# Altium project BRZ_BATT_MANAGER.PrjPcb (part 1 of 2)
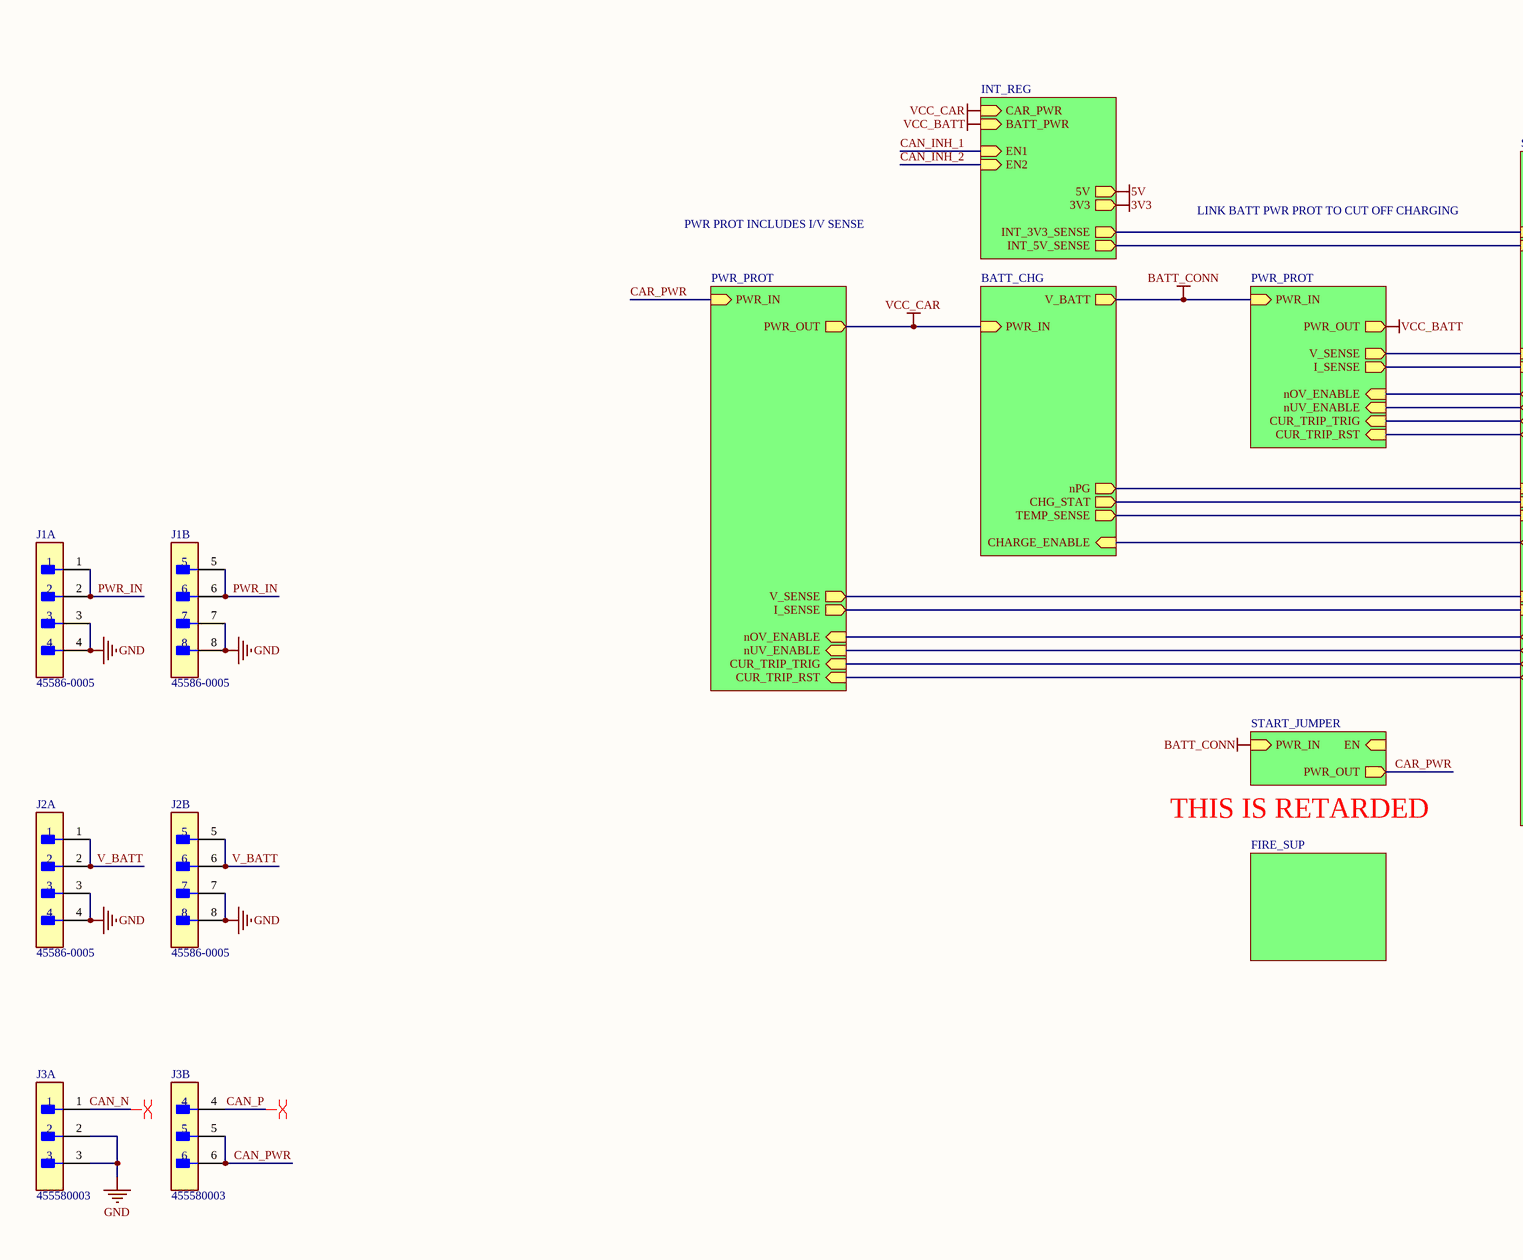
[diagram p0: BRZ_BATT_MGR.SchDoc, left]
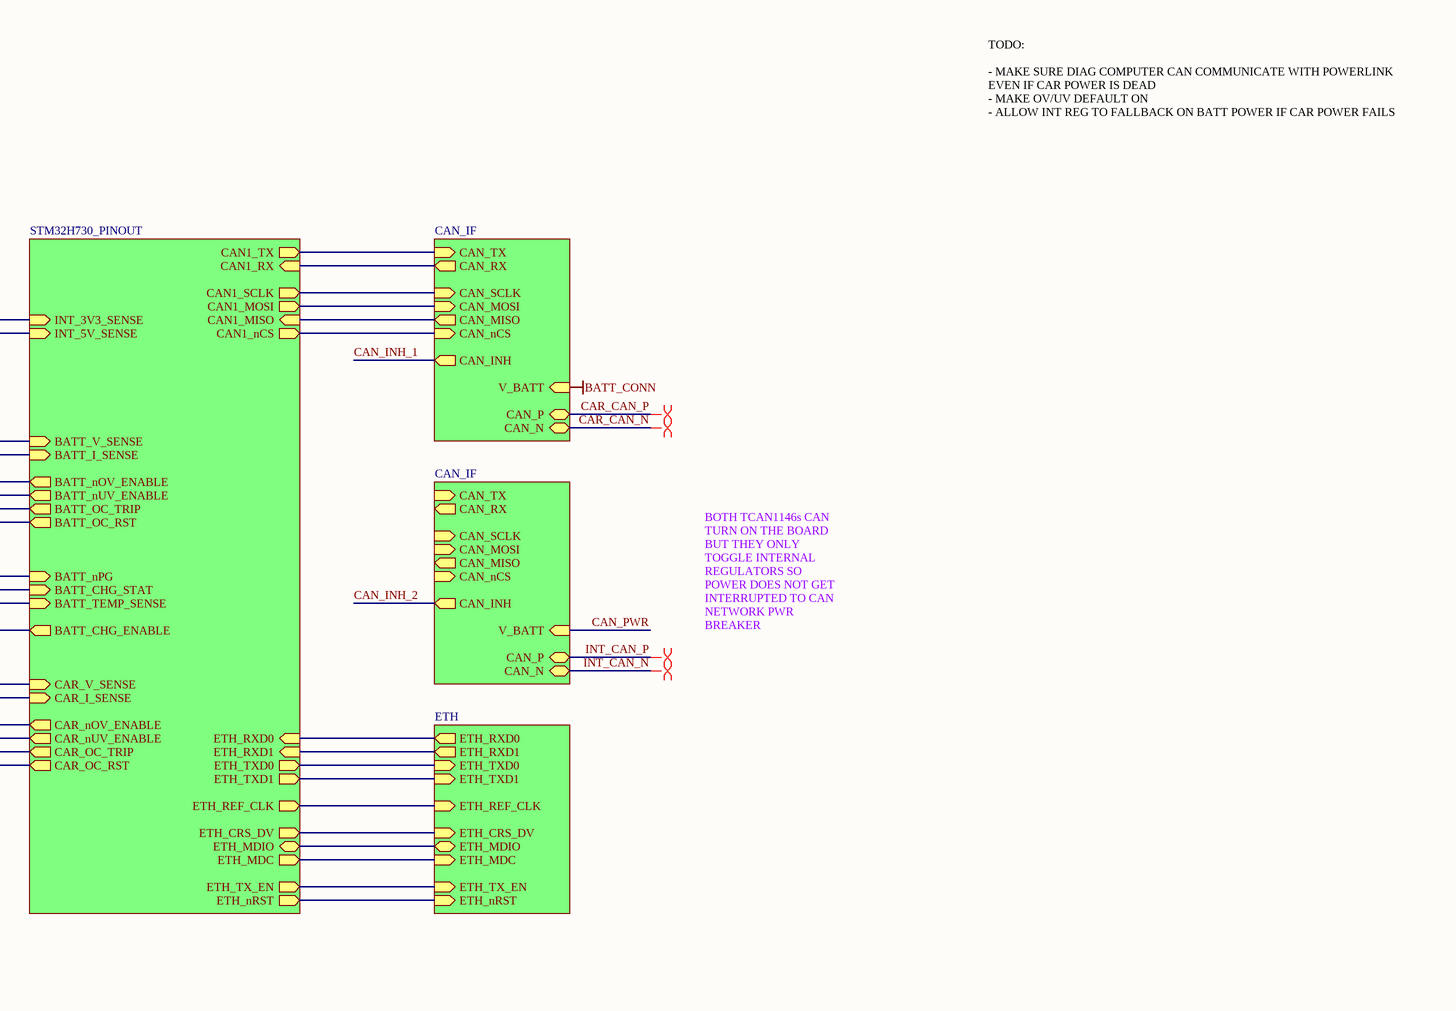
[diagram p1: BRZ_BATT_MGR.SchDoc, right]
8 sheets, 271 parts. Net scope: hierarchical (ports join the sheet entries above them; power ports are global).
Board file: BRZ_BATT_MANAGER.PcbDoc
Sheets:
  BRZ_BATT_MGR.SchDoc
    PWR_PROT_0 = PWR_PROT.SchDoc
    INT_REG = INT_REG.SchDoc
    BATT_CHG = BATT_CHG.SchDoc
    MCU = STM32H730_PINOUT.SchDoc
    PWR_PROT_2 = PWR_PROT.SchDoc
    CAN_IF_0 = CAN_IF.SchDoc
    CAN_IF_1 = CAN_IF.SchDoc
    ETH_0 = ETH.SchDoc
    START_JUMPER = START_JUMPER.SchDoc

## Sheet BRZ_BATT_MGR.SchDoc
size B; SheetNumber: 1; SheetTotal: 9

### Parts
J1  45586-0005  [FP-45586-0005-MFG]  (parts A,B of 2)
J2  45586-0005  [FP-45586-0005-MFG]  (parts A,B of 2)
J3  455580003  [FP-455580003-MFG]  (parts A,B of 2)

### Sub-sheets
BATT_CHG = BATT_CHG: PWR_IN (in), V_BATT (out), nPG (out), CHG_STAT (out), TEMP_SENSE (out), CHARGE_ENABLE (in)
CAN_IF_0 = CAN_IF: CAN_TX (in), CAN_RX (out), CAN_SCLK (in), CAN_MISO (out), CAN_MOSI (in), CAN_nCS (in), V_BATT (in), CAN_INH (out), CAN_P (bidir), CAN_N (bidir)
CAN_IF_1 = CAN_IF: CAN_TX (in), CAN_RX (out), CAN_SCLK (in), CAN_MISO (out), CAN_MOSI (in), CAN_nCS (in), CAN_P (bidir), CAN_N (bidir), V_BATT (in), CAN_INH (out)
ETH_0 = ETH: ETH_RXD0 (out), ETH_RXD1 (out), ETH_TXD0 (in), ETH_TXD1 (in), ETH_REF_CLK (in), ETH_CRS_DV (in), ETH_MDIO (bidir), ETH_MDC (in), ETH_nRST (in), ETH_TX_EN (in)
FIRE_SUP = FIRE_SUP (file not in this document): no entries
INT_REG = INT_REG: INT_3V3_SENSE (out), INT_5V_SENSE (out), 5V (out), 3V3 (out), EN1 (in), EN2 (in), CAR_PWR (in), BATT_PWR (in)
MCU = STM32H730_PINOUT: INT_3V3_SENSE (in), INT_5V_SENSE (in), BATT_V_SENSE (in), BATT_I_SENSE (in), BATT_nOV_ENABLE (out), BATT_nUV_ENABLE (out), BATT_OC_TRIP (out), BATT_OC_RST (out), BATT_nPG (in), BATT_CHG_STAT (in), BATT_TEMP_SENSE (in), BATT_CHG_ENABLE (out), CAR_V_SENSE (in), CAR_I_SENSE (in), CAR_nOV_ENABLE (out), CAR_nUV_ENABLE (out), CAR_OC_TRIP (out), CAR_OC_RST (out), CAN1_TX (out), CAN1_RX (in), CAN1_SCLK (out), CAN1_MOSI (out), CAN1_MISO (in), CAN1_nCS (out), ETH_TX_EN (out), ETH_nRST (out), ETH_MDC (out), ETH_MDIO (bidir), ETH_CRS_DV (out), ETH_REF_CLK (out), ETH_RXD1 (in), ETH_TXD0 (out), ETH_TXD1 (out), ETH_RXD0 (in)
PWR_PROT_0 = PWR_PROT: PWR_OUT (out), PWR_IN (in), V_SENSE (out), I_SENSE (out), CUR_TRIP_RST (in), CUR_TRIP_TRIG (in), nOV_ENABLE (in), nUV_ENABLE (in)
PWR_PROT_2 = PWR_PROT: PWR_OUT (out), PWR_IN (in), V_SENSE (out), I_SENSE (out), CUR_TRIP_TRIG (in), CUR_TRIP_RST (in), nOV_ENABLE (in), nUV_ENABLE (in)
START_JUMPER = START_JUMPER: PWR_IN (in), PWR_OUT (out), EN (in)

### Nets
BATT_CONN: sheet BATT_CHG/V_BATT, sheet PWR_PROT_2/PWR_IN, sheet CAN_IF_0/V_BATT, sheet START_JUMPER/PWR_IN  [project net PWR_IN]
GND: J1.3 J1.4 J1.7 J1.8 J2.3 J2.4 J2.7 J2.8 J3.2 J3.3
VCC_BATT: sheet INT_REG/BATT_PWR, sheet PWR_PROT_2/PWR_OUT  [project net PWR_OUT]
VCC_CAR: sheet PWR_PROT_0/PWR_OUT, sheet INT_REG/CAR_PWR, sheet BATT_CHG/PWR_IN  [project net PWR_OUT]
BATT_CHG_ENABLE: sheet BATT_CHG/CHARGE_ENABLE, sheet MCU/BATT_CHG_ENABLE
BATT_CHG_STAT: sheet BATT_CHG/CHG_STAT, sheet MCU/BATT_CHG_STAT
BATT_I_SENSE: sheet MCU/BATT_I_SENSE, sheet PWR_PROT_2/I_SENSE
BATT_nOV_ENABLE: sheet MCU/BATT_nOV_ENABLE, sheet PWR_PROT_2/nOV_ENABLE
BATT_nPG: sheet BATT_CHG/nPG, sheet MCU/BATT_nPG
BATT_nUV_ENABLE: sheet MCU/BATT_nUV_ENABLE, sheet PWR_PROT_2/nUV_ENABLE
BATT_OC_RST: sheet MCU/BATT_OC_RST, sheet PWR_PROT_2/CUR_TRIP_RST
BATT_OC_TRIP: sheet MCU/BATT_OC_TRIP, sheet PWR_PROT_2/CUR_TRIP_TRIG
BATT_TEMP_SENSE: sheet BATT_CHG/TEMP_SENSE, sheet MCU/BATT_TEMP_SENSE
BATT_V_SENSE: sheet MCU/BATT_V_SENSE, sheet PWR_PROT_2/V_SENSE
CAN1_MISO: sheet MCU/CAN1_MISO, sheet CAN_IF_0/CAN_MISO
CAN1_MOSI: sheet MCU/CAN1_MOSI, sheet CAN_IF_0/CAN_MOSI
CAN1_nCS: sheet MCU/CAN1_nCS, sheet CAN_IF_0/CAN_nCS
CAN1_RX: sheet MCU/CAN1_RX, sheet CAN_IF_0/CAN_RX
CAN1_SCLK: sheet MCU/CAN1_SCLK, sheet CAN_IF_0/CAN_SCLK
CAN1_TX: sheet MCU/CAN1_TX, sheet CAN_IF_0/CAN_TX
CAN_INH_1: sheet INT_REG/EN1, sheet CAN_IF_0/CAN_INH  [project net CAN_INH]
CAN_INH_2: sheet INT_REG/EN2, sheet CAN_IF_1/CAN_INH  [project net CAN_INH]
CAN_N: J3.1
CAN_P: J3.4
CAN_PWR: J3.5 J3.6 ; sheet CAN_IF_1/V_BATT
CAR_I_SENSE: sheet PWR_PROT_0/I_SENSE, sheet MCU/CAR_I_SENSE
CAR_nOV_ENABLE: sheet PWR_PROT_0/nOV_ENABLE, sheet MCU/CAR_nOV_ENABLE
CAR_nUV_ENABLE: sheet PWR_PROT_0/nUV_ENABLE, sheet MCU/CAR_nUV_ENABLE
CAR_OC_RST: sheet PWR_PROT_0/CUR_TRIP_RST, sheet MCU/CAR_OC_RST
CAR_OC_TRIP: sheet PWR_PROT_0/CUR_TRIP_TRIG, sheet MCU/CAR_OC_TRIP
CAR_PWR: sheet PWR_PROT_0/PWR_IN, sheet START_JUMPER/PWR_OUT
CAR_V_SENSE: sheet PWR_PROT_0/V_SENSE, sheet MCU/CAR_V_SENSE
ETH_CRS_DV: sheet MCU/ETH_CRS_DV, sheet ETH_0/ETH_CRS_DV
ETH_MDC: sheet MCU/ETH_MDC, sheet ETH_0/ETH_MDC
ETH_MDIO: sheet MCU/ETH_MDIO, sheet ETH_0/ETH_MDIO
ETH_nRST: sheet MCU/ETH_nRST, sheet ETH_0/ETH_nRST
ETH_REF_CLK: sheet MCU/ETH_REF_CLK, sheet ETH_0/ETH_REF_CLK
ETH_RXD0: sheet MCU/ETH_RXD0, sheet ETH_0/ETH_RXD0
ETH_RXD1: sheet MCU/ETH_RXD1, sheet ETH_0/ETH_RXD1
ETH_TX_EN: sheet MCU/ETH_TX_EN, sheet ETH_0/ETH_TX_EN
ETH_TXD0: sheet MCU/ETH_TXD0, sheet ETH_0/ETH_TXD0
ETH_TXD1: sheet MCU/ETH_TXD1, sheet ETH_0/ETH_TXD1
INT_3V3_SENSE: sheet INT_REG/INT_3V3_SENSE, sheet MCU/INT_3V3_SENSE
INT_5V_SENSE: sheet INT_REG/INT_5V_SENSE, sheet MCU/INT_5V_SENSE
PWR_IN: J1.1 J1.2 J1.5 J1.6
V_BATT: J2.1 J2.2 J2.5 J2.6

### Layout directives
differential pair: CAN_N, CAN_N_CAN_IF_0, CAN_N_CAN_IF_1, CAN_P, CAN_P_CAN_IF_0, CAN_P_CAN_IF_1

### Notes on the sheet
- PWR PROT INCLUDES I/V SENSE
- LINK BATT PWR PROT TO CUT OFF CHARGING
- TODO:
  - MAKE SURE DIAG COMPUTER CAN COMMUNICATE WITH POWERLINK EVEN IF CAR POWER IS DEAD
  - MAKE OV/UV DEFAULT ON
  - ALLOW INT REG TO FALLBACK ON BATT POWER IF CAR POWER FAILS
- BOTH TCAN1146s CAN TURN ON THE BOARD BUT THEY ONLY TOGGLE INTERNAL REGULATORS SO POWER DOES NOT GET INTERRUPTED TO CAN NETWORK PWR BREAKER
- THIS IS RETARDED

### Library data of the parts
J1 J2 = CMP-04776-000690-1: CONN HEADER R/A 8POS 4.2MM
J3 = CMP-04776-000024-1: CONN HEADER R/A 6POS 4.2MM; Manufacturer: Molex; Standoff Height: 0.4mm; Conn Orientation: Right Angle; Number Of Contacts: 6; Conn Gender: Male; Voltage Rating: 600V; Current Rating: 8A; Footprint Url: https://www.molex.com/pdm_docs/sd/455580003_sd.pdf; Number Of Rows: 2; Lead Free: Yes; Digikey Description: CONN HEADER R/A 6POS 4.2MM; ComponentLink2URL: https://www.molex.com/webdocs/datasheets/pdf/en-us/0455580003_PCB_HEADERS.pdf; Octopart: https://octopart.com/45558-0003-molex-7672845; Package: 0; Device Class L3: unset; ComponentLink2Description: Datasheet; Device Class L2: Headers and Wire Housings; Category: Conn; Contact Material: Tin,Nickel; Mouser Description: Conn Power HDR 6 POS 4.2mm Solder ST Thru-Hole 6 Terminal 1 Port Mini-Fit Jr™ Tray; Manufacturer Part Number: 455580003; Pitch: 4.2mm; Device Class L1: Connectors; Temperature Range Low: -40°C; Temperature: -40°C to +105°C; RoHS: TRUE; Temperature Range High: +105°C; Height: 10.38mm; Automotive: No

## Sheet PWR_PROT.SchDoc
size C; SheetNumber: 3; SheetTotal: 9
Used 2 times, as channels PWR_PROT_0, PWR_PROT_2. Parts and nets are listed once, with the designators drawn on the sheet.
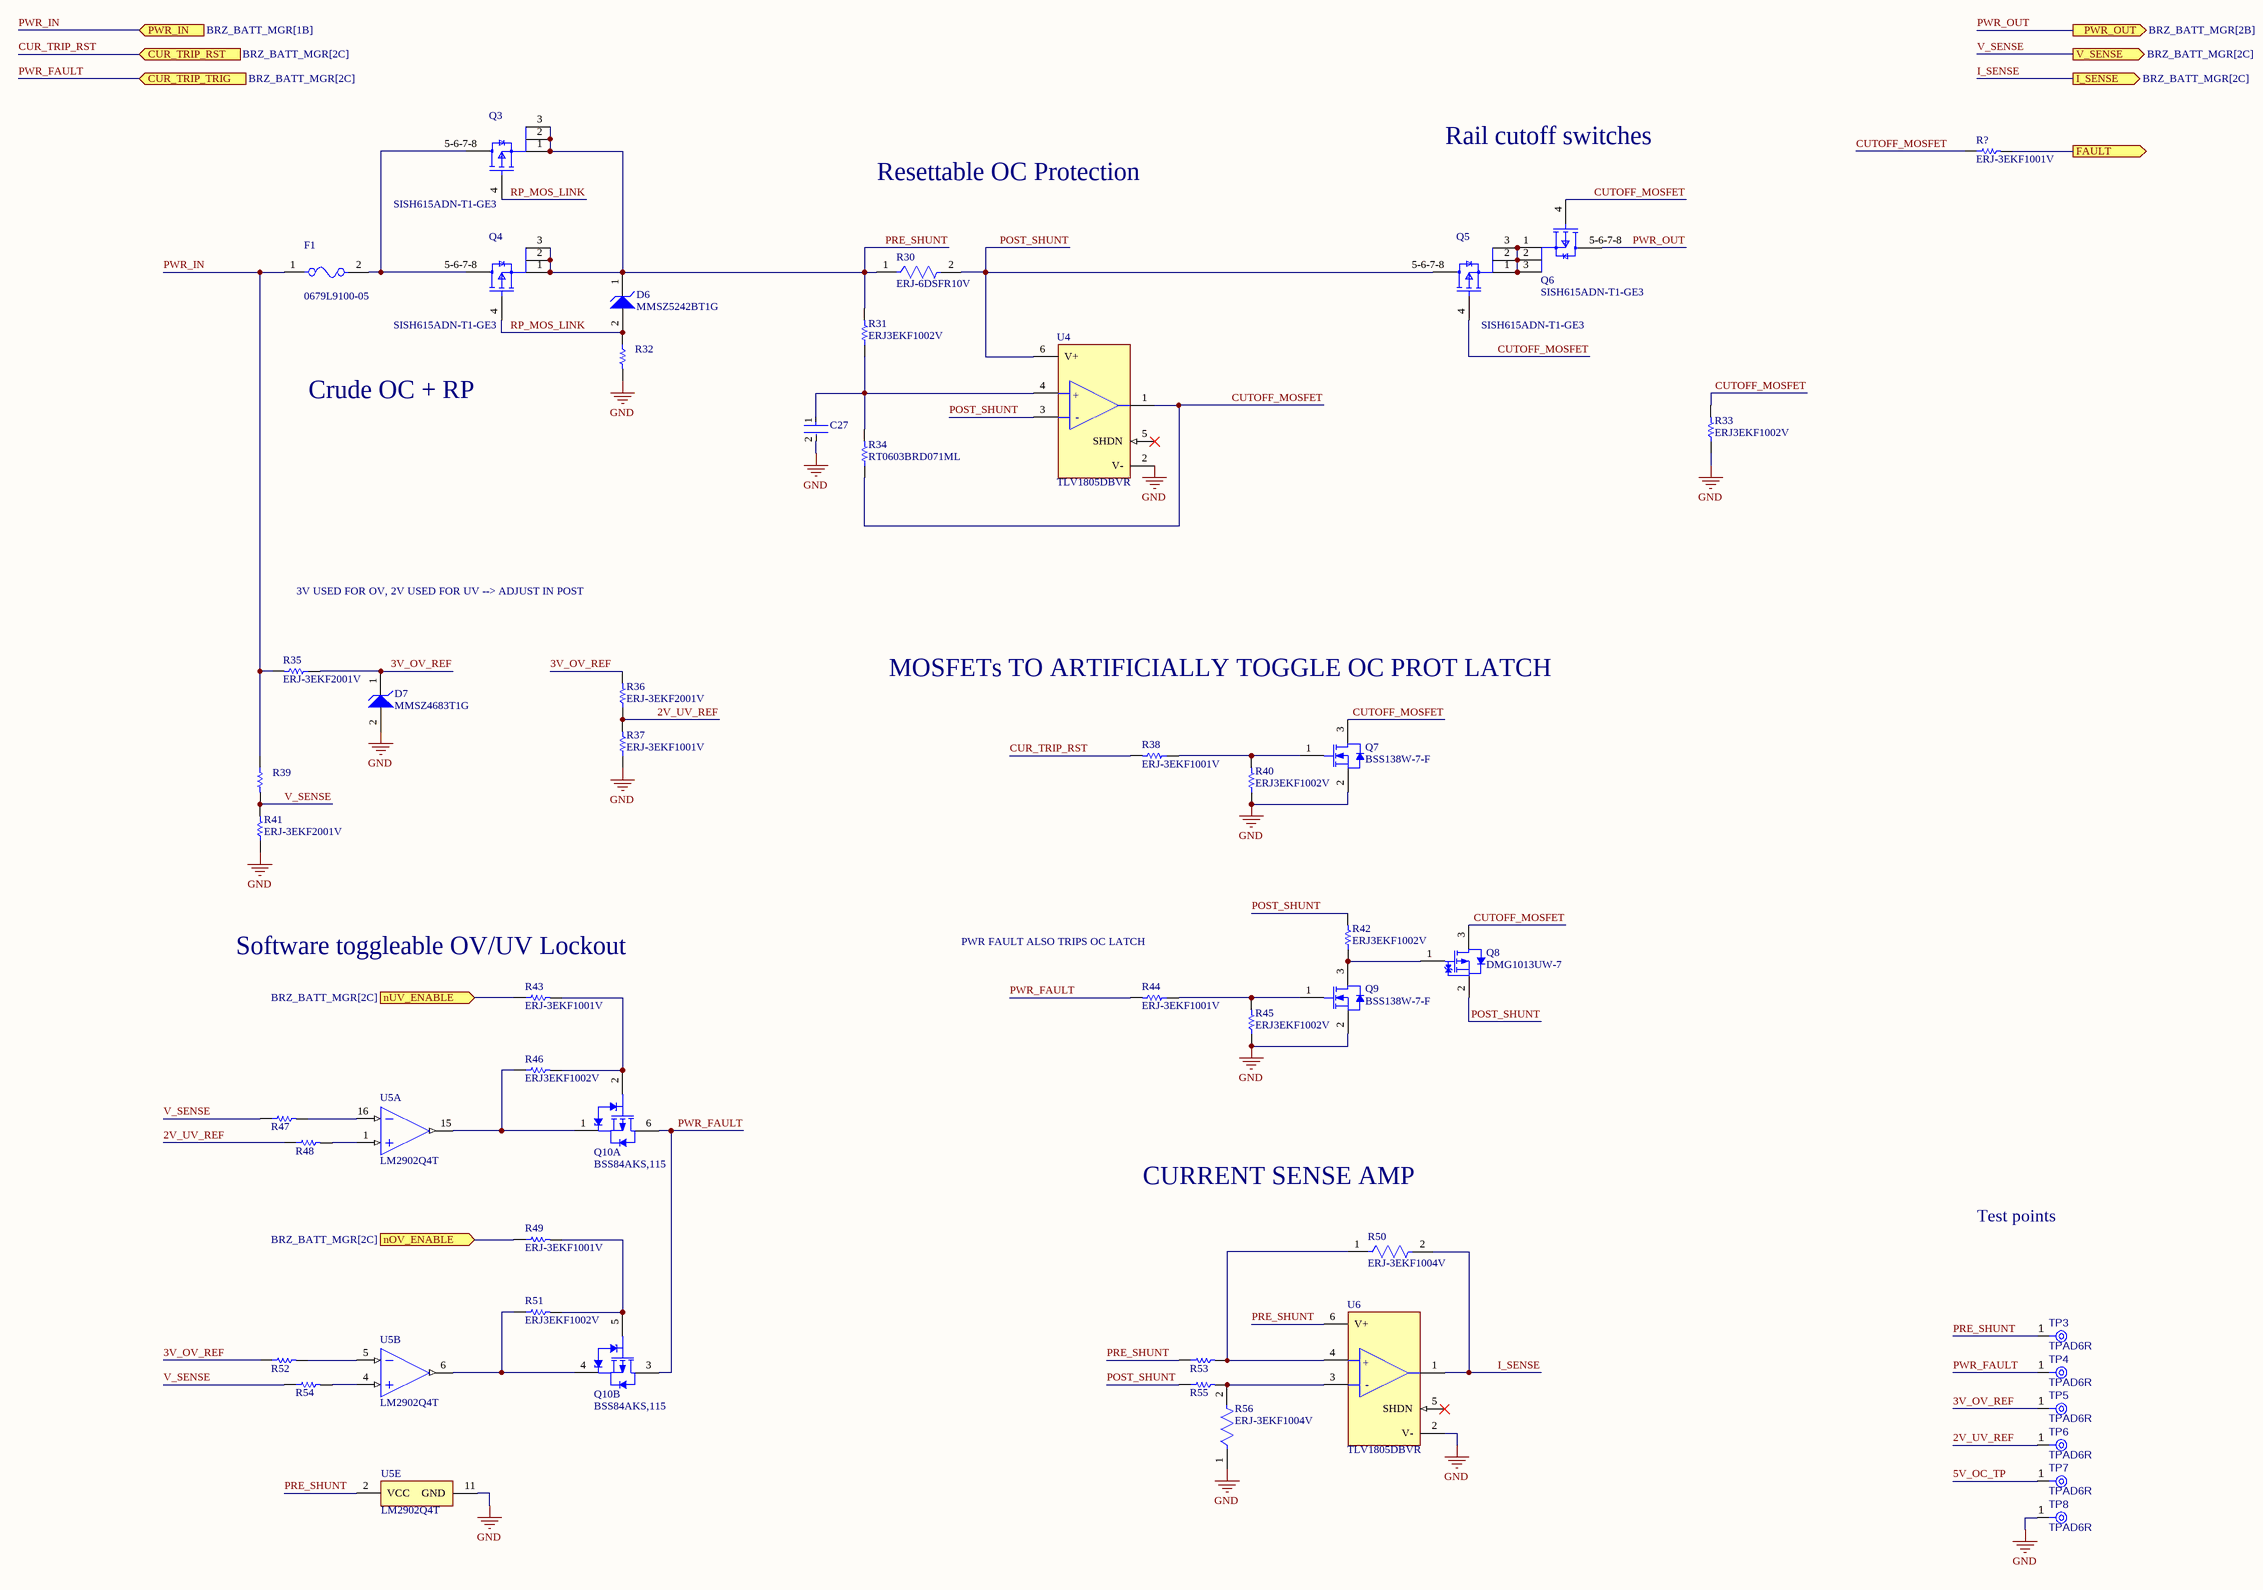
[diagram p2: PWR_PROT.SchDoc]

### Parts
C27  GRM188R71H104KA93D  [FP-0402-L_1_0_0_05-W_0_5-IPC_A]  (value not drawn)
D6  MMSZ5242BT1G  [ONSC-SOD-123-2-425-04_V]
D7  MMSZ4683T1G  [ONSC-SOD-123-2-425-04_V]
F1  0679L9100-05  [FP-0679L-MFG]
Q3  SISH615ADN-T1-GE3  [SISH615ADN-T1-GE3-Footprint-1]
Q4  SISH615ADN-T1-GE3  [SISH615ADN-T1-GE3-Footprint-1]
Q5  SISH615ADN-T1-GE3  [SISH615ADN-T1-GE3-Footprint-1]
Q6  SISH615ADN-T1-GE3  [SISH615ADN-T1-GE3-Footprint-1]
Q7  BSS138W-7-F  [DIOD-SOT323-3_V]
Q8  DMG1013UW-7  [DIOD-SOT323-3_V]
Q9  BSS138W-7-F  [DIOD-SOT323-3_V]
Q10  BSS84AKS,115  [NXP-SOT363_L]  (parts A,B of 2)
R30  ERJ-6DSFR10V  [FP-ERJ6D-MFG]
R31  ERJ3EKF1002V  [RESC1609X55X30LL15T15]
R32  ERJ3EKF1002V  [RESC1609X55X30LL15T15]  (value not drawn)
R33  ERJ3EKF1002V  [RESC1609X55X30LL15T15]
R34  RT0603BRD071ML  [RESC1608X55X30NL20T20]
R35  ERJ-3EKF2001V  [RESC1608X55X30ML15T15]
R36  ERJ-3EKF2001V  [RESC1608X55X30ML15T15]
R37  ERJ-3EKF1001V  [RESC1608X55X30LL15T15]
R38  ERJ-3EKF1001V  [RESC1608X55X30LL15T15]
R39  ERJ3EKF1002V  [RESC1609X55X30LL15T15]  (value not drawn)
R40  ERJ3EKF1002V  [RESC1609X55X30LL15T15]
R41  ERJ-3EKF2001V  [RESC1608X55X30ML15T15]
R42  ERJ3EKF1002V  [RESC1609X55X30LL15T15]
R43  ERJ-3EKF1001V  [RESC1608X55X30LL15T15]
R44  ERJ-3EKF1001V  [RESC1608X55X30LL15T15]
R45  ERJ3EKF1002V  [RESC1609X55X30LL15T15]
R46  ERJ3EKF1002V  [RESC1609X55X30LL15T15]
R47  ERJ3EKF1002V  [RESC1609X55X30LL15T15]  (value not drawn)
R48  ERJ3EKF1002V  [RESC1609X55X30LL15T15]  (value not drawn)
R49  ERJ-3EKF1001V  [RESC1608X55X30LL15T15]
R50  ERJ-3EKF1004V  [FP-ERJ3EK-IPC_C]
R51  ERJ3EKF1002V  [RESC1609X55X30LL15T15]
R52  ERJ3EKF1002V  [RESC1609X55X30LL15T15]  (value not drawn)
R53  ERJ3EKF1002V  [RESC1609X55X30LL15T15]  (value not drawn)
R54  ERJ3EKF1002V  [RESC1609X55X30LL15T15]  (value not drawn)
R55  ERJ3EKF1002V  [RESC1609X55X30LL15T15]  (value not drawn)
R56  ERJ-3EKF1004V  [FP-ERJ3EK-IPC_C]
R?  ERJ-3EKF1001V  [RESC1608X55X30LL15T15]
TP3  TPAD6R  [TP06R]  (no BOM)
TP4  TPAD6R  [TP06R]  (no BOM)
TP5  TPAD6R  [TP06R]  (no BOM)
TP6  TPAD6R  [TP06R]  (no BOM)
TP7  TPAD6R  [TP06R]  (no BOM)
TP8  TPAD6R  [TP06R]  (no BOM)
U4  TLV1805DBVR  [FP-DBV0006A-IPC_C]
U5  LM2902Q4T  [LM2902Q4T-Footprint-1]  (parts A,B,E of 5)
U6  TLV1805DBVR  [FP-DBV0006A-IPC_C]

### Ports
CUR_TRIP_RST (in, see BRZ_BATT_MGR[2C]), CUR_TRIP_TRIG (in, see BRZ_BATT_MGR[2C]), FAULT (out), I_SENSE (out, see BRZ_BATT_MGR[2C]), nOV_ENABLE (in, see BRZ_BATT_MGR[2C]), nUV_ENABLE (in, see BRZ_BATT_MGR[2C]), PWR_IN (in, see BRZ_BATT_MGR[1B]), PWR_OUT (out, see BRZ_BATT_MGR[2B]), V_SENSE (out, see BRZ_BATT_MGR[2C])

### Nets
GND: C27.2 D7.2(A) Q7.2(S) Q9.2(S) R32.2 R33.1 R37.1 R40.1 R41.1 R45.1 R56.1 TP8.1(TP) U4.2(V-) U5.11(GND) U6.2(V-)
2V_UV_REF: R36.1 R37.2 R48.1 TP6.1(TP)
3V_OV_REF: D7.1(K) R35.1 R36.2 R52.1 TP5.1(TP)
5V_OC_TP: TP7.1(TP)
CUR_TRIP_RST: R38.2 ; port CUR_TRIP_RST
CUTOFF_MOSFET: Q5.4(G) Q6.4(G) Q7.3(D) Q8.3(D) R33.2 R34.1 R?.1 U4.1(OUT)
FAULT: R?.2 ; port FAULT
I_SENSE: R50.2 U6.1(OUT) ; port I_SENSE
nOV_ENABLE: R49.1 ; port nOV_ENABLE
nUV_ENABLE: R43.1 ; port nUV_ENABLE
POST_SHUNT: Q5.5-6-7-8(D) Q8.2(S) R30.2 R42.2 R55.1 U4.3(-IN) U4.6(V+)
PRE_SHUNT: D6.1(K) Q3.1(S) Q3.2(S) Q3.3(S) Q4.1(S) Q4.2(S) Q4.3(S) R30.1 R31.2 R53.1 TP3.1(TP) U5.2(VCC) U6.6(V+)
PWR_FAULT: Q10.3(D2) Q10.6(D1) R44.2 TP4.1(TP) ; port CUR_TRIP_TRIG
PWR_IN: F1.1 R35.2 R39.1 ; port PWR_IN
PWR_OUT: Q6.5-6-7-8(D) ; port PWR_OUT
RP_MOS_LINK: D6.2(A) Q3.4(G) Q4.4(G) R32.1
V_SENSE: R39.2 R41.2 R47.1 R54.1 ; port V_SENSE
NetC27_1: C27.1 R31.1 R34.2 U4.4(+IN)
NetF1_2: F1.2 Q3.5-6-7-8(D) Q4.5-6-7-8(D)
NetQ5_1: Q5.1(S) Q5.2(S) Q5.3(S) Q6.1(S) Q6.2(S) Q6.3(S)
NetQ7_1: Q7.1(G) R38.1 R40.2
NetQ8_1: Q8.1(G) Q9.3(D) R42.1
NetQ9_1: Q9.1(G) R44.1 R45.2
NetQ10_1: Q10.1(S1) R46.1 U5.15(1OUT)
NetQ10_2: Q10.2(G1) R43.2 R46.2
NetQ10_4: Q10.4(S2) R51.1 U5.6(2OUT)
NetQ10_5: Q10.5(G2) R49.2 R51.2
NetR47_2: R47.2 U5.16(1IN-)
NetR48_2: R48.2 U5.1(1IN+)
NetR50_1: R50.1 R53.2 U6.4(+IN)
NetR52_2: R52.2 U5.5(2IN-)
NetR54_2: R54.2 U5.4(2IN+)
NetR55_2: R55.2 R56.2 U6.3(-IN)

Not connected (* = marked no-connect by the designer): U4 5(SHDN)*; U6 5(SHDN)*

### Channels
PWR_PROT_0: designators end in _PWR_PROT_0; ports CUR_TRIP_RST=CAR_OC_RST CUR_TRIP_TRIG=CAR_OC_TRIP FAULT=NetR?_PWR_PROT_0_2 I_SENSE=CAR_I_SENSE nOV_ENABLE=CAR_nOV_ENABLE nUV_ENABLE=CAR_nUV_ENABLE PWR_IN=CAR_PWR PWR_OUT=PWR_OUT V_SENSE=CAR_V_SENSE
PWR_PROT_2: designators end in _PWR_PROT_2; ports CUR_TRIP_RST=BATT_OC_RST CUR_TRIP_TRIG=BATT_OC_TRIP FAULT=NetR?_PWR_PROT_2_2 I_SENSE=BATT_I_SENSE nOV_ENABLE=BATT_nOV_ENABLE nUV_ENABLE=BATT_nUV_ENABLE PWR_IN=PWR_IN PWR_OUT=PWR_OUT V_SENSE=BATT_V_SENSE

### Notes on the sheet
- Rail cutoff switches
- Resettable OC Protection
- Crude OC + RP
- 3V USED FOR OV, 2V USED FOR UV --> ADJUST IN POST
- MOSFETs TO ARTIFICIALLY TOGGLE OC PROT LATCH
- (near R43) Software toggleable OV/UV Lockout
- PWR FAULT ALSO TRIPS OC LATCH
- CURRENT SENSE AMP
- Test points
- (in symbol CMP-04896-000098-1) +; -

### Library data of the parts
C27 = CMP-001-00058-1: LARGE PADS, 0402 CAP, CHANGE COMMENT TO MATCH REAL P/N; Capacitor Type: Ceramic; Min Operating Temperature: -55°C; Mounting Technology: Surface Mount; Pins: 2; Case/Package: 0402; RoHS Compliant: Yes; Max Operating Temperature: 85°C
D6 = CMP-1060-00565-1: Zener Voltage Regulator, 500 mW, 2-Pin SOD-123, Pb-Free, Tape and Reel; Manufacturer: On Semiconductor; P Max (W): 0.5; VZ Typ (V): 12; PartNumber: MMSZ5242BT1G; PackageReference: SOD-123-2-425-04; ComponentLink3URL: http://www.onsemi.com/pub_link/Collateral/425-04.PDF; Mounting Technology: Surface Mount; ComponentLink2Description: Datasheet; ComponentLink1URL: http://www.onsemi.com/; ComponentLink3Description: Package Specification; PackageDescription: 2-Pin SOD, Body 1.6 x 2.69 mm; PackageVersion: Rev. G, 10/2009; ComponentLink1Description: Manufacturer URL; RoHS: Pb-Free; ComponentLink2URL: http://www.onsemi.com/pub_link/Collateral/MMSZ5221BT1-D.PDF; Packing: Tape and Reel; DatasheetVersion: Rev. 12
D7 = CMP-1060-00600-1: Zener Voltage Regulator, 500 mW, 2-Pin SOD-123, Pb-Free, Tape and Reel; Manufacturer: On Semiconductor; P Max (W): 0.5; VZ Typ (V): 3; ComponentLink2Description: Datasheet; ComponentLink3URL: http://www.onsemi.com/pub_link/Collateral/425-04.PDF; PackageVersion: Rev. G, 10/2009; RoHS: Pb-Free; ComponentLink2URL: http://www.onsemi.com/pub_link/Collateral/MMSZ4678T1-D.PDF; DatasheetVersion: Rev. 9; PackageDescription: 2-Pin SOD, Body 1.6 x 2.69 mm; PartNumber: MMSZ4683T1G; ComponentLink3Description: Package Specification; ComponentLink1URL: http://www.onsemi.com/; ComponentLink1Description: Manufacturer URL; Packing: Tape and Reel; PackageReference: SOD-123-2-425-04; Mounting Technology: Surface Mount
F1 = CMP-16042-000002-1: DIFF P#!!! / FUSE BRD MNT 10A 125VAC/VDC; Manufacturer: Bel Fuse; Manufacturer Part Number: 0679L9150-01; Max Fuse Ac Voltage: 125V; Fuse Blow Speed: Fast; Fuse Current: 15A; Fuse I2T: 103.5A2Sec; Fuse Interrupt Ac Current: 50A; Automotive Grade: Grade 1; Value: 0.0038Ω; Fuse Interrupt Dc Current: 300A; Fuse Voltage Drop: 0.13V; Device Class L2: Fuses; ComponentLink2URL: https://www.belfuse.com/resources/CircuitProtection/datasheets/0679L%20Sep2016.pdf; Package: 0679L; Height: 2.79mm; Digikey Description: FUSE BRD MNT 15A 125VAC/VDC; Temperature Range High: +125°C; Device Class L3: unset; Octopart: https://octopart.com/0679l9150-01-bel+fuse-70850665; Temperature Range Low: -55°C; Max Fuse Dc Voltage: 125V; Ipc Land Pattern Name: CAPC610254X254; Category: Fuse; Lead Free: Yes; Automotive: Yes; Resistance: 0.0038Ω; RoHS: TRUE; Device Class L1: Circuit Protection; ComponentLink2Description: Datasheet; Temperature: -55°C to +125°C; Voltage Rating: 125V
Q3 Q4 = CMP-013-00036-2: Trans MOSFET P-CH 20V 22.1A 8-Pin PowerPAK 1212 EP T/R
Q5 Q6 = CMP-013-00036-1: Trans MOSFET P-CH 20V 22.1A 8-Pin PowerPAK 1212 EP T/R
Q7 Q9 = CMP-2000-05968-1: N-Channel Enhancement Mode Mosfet, 50 V, 200 mA, -55 to 150 degC, 6-Pin SOT-323, RoHS, Tape and Reel; Typical Turn-Off Delay Time: 20ns; Number of Channels: 1Channel; Type: EnhancementModeFieldEffectTransistor; Brand: DiodesIncorporated; Vds - Drain-Source Breakdown Voltage: 75V; Vgs - Gate-Source Voltage: 20V; Rds On - Drain-Source Resistance: 1.4Ohms; Transistor Type: 1N-Channel; Configuration: Single; Unit Weight: 0.000212oz; Pd - Power Dissipation: 200mW; Id - Continuous Drain Current: 200mA; Forward Transconductance - Min: 0.1S; Manufacturer URL: http://www.diodes.com/; Series: BSS138; Package Description: 3-Pin Small Outline Transistor, Body 2 x 1.25 mm, Pitch 0.65 mm; Mounting Technology: SurfaceMount; Product Category: MOSFET; RoHS: True; Maximum Operating Temperature: +150C; Height: 1mm; Length: 2.2mm; Technology: Si; Width: 1.35mm; Datasheet URL: http://www.diodes.com/_files/datasheets/ds30206.pdf; Manufacturer: DiodesIncorporated; Package / Case: SOT-323-3; Typical Turn-On Delay Time: 20ns; Transistor Polarity: N-Channel; Factory Pack Quantity: 3000; Packaging: Reel; Product: MOSFETSmallSignal; Datasheet Version: Rev. 11-2, 09/2013; Package Reference: SOT323; Minimum Operating Temperature: -55C; Mounting Style: SMD/SMT; Channel Mode: Enhancement
Q8 = CMP-2000-06170-1: P-Channel Enhancement Mode MOSFET, 310 mW, 20 V, -55 to 150 degC, 3-Pin SOT-323, RoHS, Tape and Reel; Manufacturer: Diodes Inc; Qg Gate Charge: 0.622nC; Drain-Source On Resistance-Max: 750mO; Rated Power Dissipation: 310mW; Drain-to-Source Voltage [Vdss]: 20V; Package Reference: SOT323; Datasheet Version: Rev. 3-2, 09/2013; Package Description: 3-Pin Small Outline Transistor, Body 2 x 1.25 mm, Pitch 0.65 mm; Mounting Technology: SurfaceMount; Manufacturer URL: http://www.diodes.com/; Datasheet URL: http://www.diodes.com/_files/datasheets/ds31861.pdf; Channel Type: P-Channel
Q10 = CMP-1259-00116-1: Dual P-Channel Trench MOSFET, -50 V, -0.16 A, -55 to 150 degC, 6-Pin SOT363, Tape and Reel; Manufacturer: NXP Semiconductors; VGSth [typ] (V): -1.6; Automotive Qualified: Y; Channel Type: P; IDM [max] (A): -0.64; Packing: Tape & Reel; Mounting Technology: Surface Mount; PackageDescription: 6-Pin Small Outline Transistor Package, Body 2 x 1.25 mm, Pitch 0.65 mm; ComponentLink2URL: http://www.nxp.com/documents/data_sheet/BSS84AKS.pdf; ComponentLink3URL: http://www.nxp.com/documents/outline_drawing/sot363_po.pdf; PartNumber: BSS84AKS,115; PackageReference: SOT363; PackageVersion: 06-03-16, 03/2006; ComponentLink3Description: Package Specification; ComponentLink2Description: Datasheet; ComponentLink1Description: Manufacturer URL; VDS [max] (V): -50; Code_JEITA: SC-88; ID [max] (A): -0.16; DatasheetVersion: Rev. 1; ComponentLink1URL: http://www.nxp.com/
R30 = CMP-05422-000098-1: RES 0.1 OHM 1% 1/2W 0805; Temperature Coefficient: 150ppm/°C; Resistance: 100mR; Max Power Dissipation: 500mW; Tolerance: 1%; Length: 0.079inch; Features: Automotive AEC-Q200; Width: 0.049inch; Resistor Type: Thick Film; Case Code (Metric): 2012; Number of Terminations: 2; Max Operating Temperature: 155°C; Case/Package: 0805; Height: 0.028inch; Packaging: Cut Tape; Case Code (Imperial): 0805; Min Operating Temperature: -55°C
R31-R33 R39 R40 R42 R45-R48 R51-R55 = CMP-1012-00623-3: Chip Resistor, 10 KOhm, +/- 1%, 0.1 W, -55 to 155 degC, 0603 (1608 Metric), RoHS, Tape and Reel; Manufacturer: Panasonic; Voltage Rating: 75V; Case\/Package: 0603; Power Rating: 100mW; Resistance: 10KOhm; Temperature Coefficient: 100ppm\/degreesC; Number of Pins: 2; Package Reference: 603; Depth: 0.8mm; Mount: SurfaceMount; Package Description: 2-Pin Surface Mount Device, Body 1.6 x 0.85 mm; Datasheet Version: 02/2017; Length: 1.6mm; Lead Free: LeadFree; Height: 0.45mm; Number of Terminations: 2; Max Power Dissipation: 100mW; Min Operating Temperature: -55degC; Datasheet URL: https://industrial.panasonic.com/cdbs/www-data/pdf/RDA0000/AOA0000C304.pdf; Termination: SMD/SMT; Case Code (Metric): 1608; Case Code (Imperial): 0603; Tolerance: 1%; Max Operating Temperature: 155degC; RoHSCompliant: true; Voltage Rating (DC): 75V; Radiation Hardening: No; Packaging: TapeandReel; Composition: ThickFilm; Mounting Technology: SurfaceMount; Manufacturer URL: http://www.panasonic.com/; Width: 0.031inch; REACH SVHC: NoSVHC; Contact Plating: Tin; Military Standard: Not; Package Quantity: 1
R34 = CMP-2000-00925-1: NOT PANASONIC, THIS IS A 1M RESISTORhttps://www.yageo.com/upload/media/product/productsearch/datasheet/rchip/PYu-RT_1-to-0.01_RoHS_L_13.pdf; Part Number: ERA-3AEB163V; Manufacturer: Panasonic
R35 R36 R41 = CMP-2000-00317-1: Manufacturer: Panasonic; Part Number: ERJ-3EKF2001V
R37 R38 R43 R44 R49 R? = CMP-2000-00180-1: Manufacturer: Panasonic; Part Number: ERJ-3EKF1001V
R50 R56 = CMP-1012-00849-3: RES SMD 1M OHM 1% 1/10W 0603; Resistance: 1MR; Voltage Rating: 75V; Temperature Coefficient: 100ppm/°C; Power Rating: 100mW; REACH SVHC: No SVHC; Radiation Hardening: No; Features: Automotive AEC-Q200; Case Code (Metric): 1608; Resistance Tolerance: 1%; Case/Package: 0603; Termination: SMD/SMT; Max Operating Temperature: 155°C; Tolerance: 1%; Size Code: 0603; Case Code (Imperial): 0603; Min Operating Temperature: -55°C; Number of Pins: 2; Mount: Surface Mount; Package Quantity: 1; Military Standard: Not; Voltage Rating (DC): 75V; Depth: 0.8mm; Packaging: Tape and Reel; Width: 0.8mm; Number of Terminations: 2; Length: 1.6mm; Height: 0.022inch; RoHS Compliant: Yes; Resistor Type: Thick Film; Contact Plating: Tin; Lead Free: Lead Free; Series: ERJ; Construction: Rectangular; Max Power Dissipation: 100mW
TP3-TP8 = CMP-00028-00002-2: 0.6mm round; Pins: 1
U4 U6 = CMP-04896-000098-1: 40V, RAIL-TO-RAIL INPUT, PUSH-PU
U5 = CMP-014-00004-1: LM2902 Series 30 V 1.3 MHz Low-Power Quad Operational Amplifier - QFN-16 (3x3)

## Sheet INT_REG.SchDoc
size A4; SheetNumber: 4; SheetTotal: 9
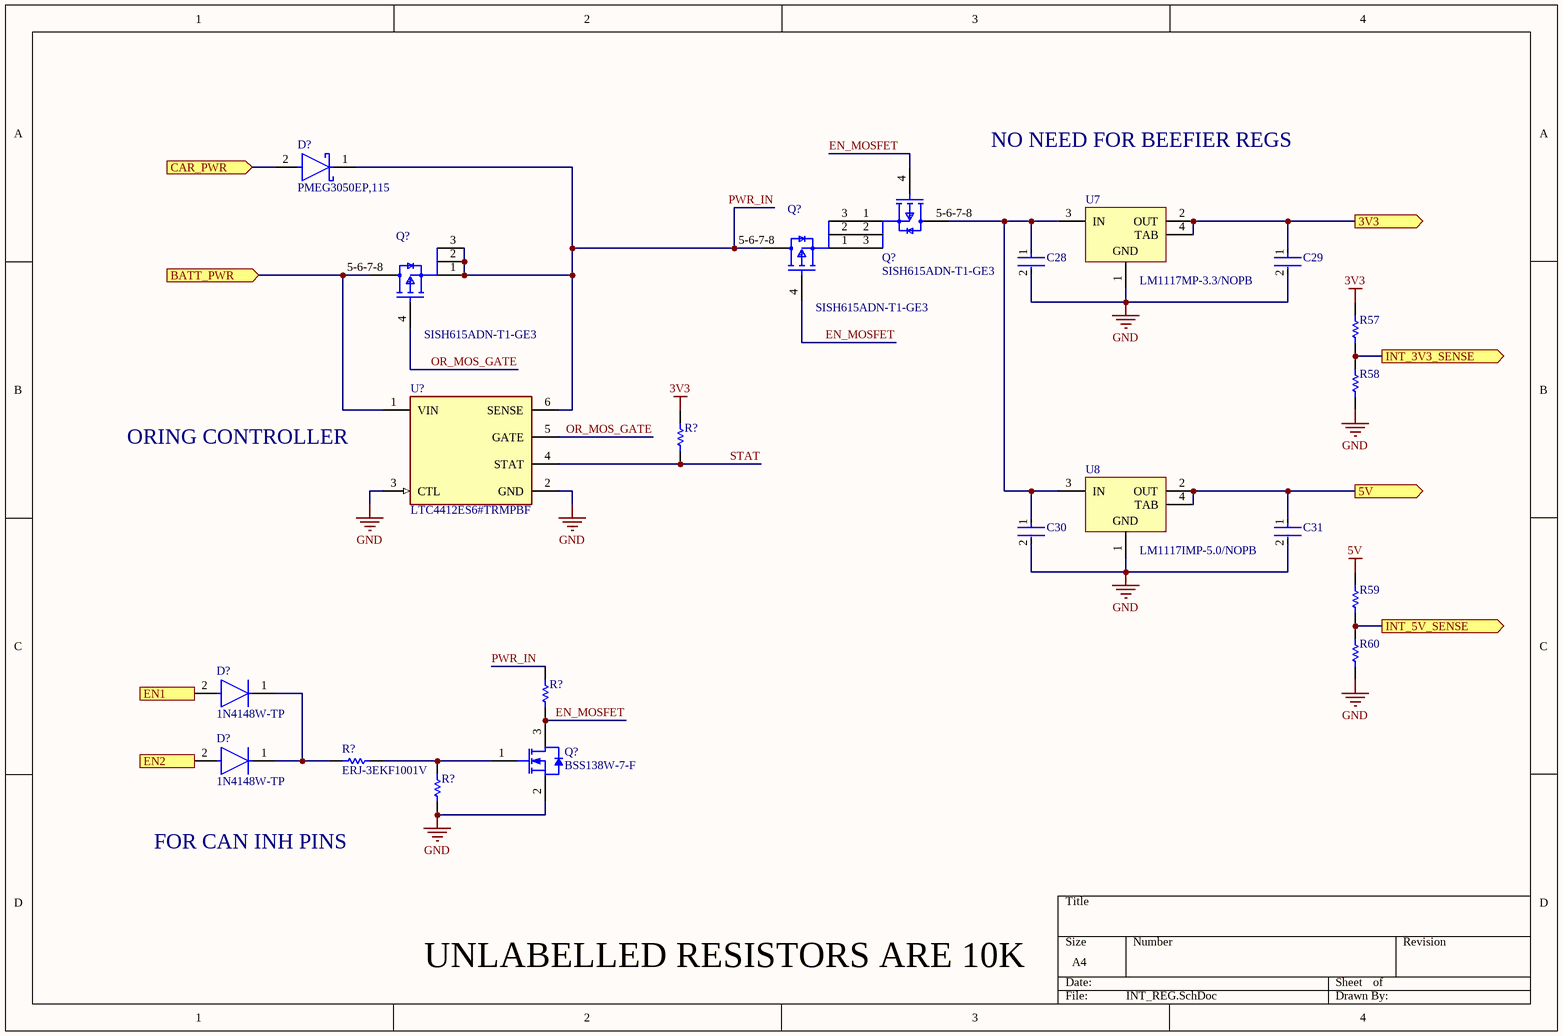
[diagram p3: INT_REG.SchDoc]

### Parts
(Parts that share a designator on the sheet are numbered #1, #2 ... from top to bottom, then left to right.)
C28  GRM188R61E106KA73D  [FP-GRM188-0_2-IPC_A]  (value not drawn)
C29  GRM188R61E106KA73D  [FP-GRM188-0_2-IPC_A]  (value not drawn)
C30  GRM188R61E106KA73D  [FP-GRM188-0_2-IPC_A]  (value not drawn)
C31  GRM188R61E106KA73D  [FP-GRM188-0_2-IPC_A]  (value not drawn)
D?#1  PMEG3050EP,115  [FP-SOD128-MFG]
D?#2  1N4148W-TP  [FP-SOD-123-IPC_A]
D?#3  1N4148W-TP  [FP-SOD-123-IPC_A]
Q?#1  SISH615ADN-T1-GE3  [SISH615ADN-T1-GE3-Footprint-1]
Q?#2  SISH615ADN-T1-GE3  [SISH615ADN-T1-GE3-Footprint-1]
Q?#3  SISH615ADN-T1-GE3  [SISH615ADN-T1-GE3-Footprint-1]
Q?#4  BSS138W-7-F  [DIOD-SOT323-3_V]
R57  ERJ3EKF1002V  [RESC1609X55X30LL15T15]  (value not drawn)
R58  ERJ3EKF1002V  [RESC1609X55X30LL15T15]  (value not drawn)
R59  ERJ3EKF1002V  [RESC1609X55X30LL15T15]  (value not drawn)
R60  ERJ3EKF1002V  [RESC1609X55X30LL15T15]  (value not drawn)
R?#1  ERJ3EKF1002V  [RESC1609X55X30LL15T15]  (value not drawn)
R?#2  ERJ3EKF1002V  [RESC1609X55X30LL15T15]  (value not drawn)
R?#3  ERJ-3EKF1001V  [RESC1608X55X30LL15T15]
R?#4  ERJ3EKF1002V  [RESC1609X55X30LL15T15]  (value not drawn)
U7  LM1117MP-3.3/NOPB  [DCY0004A_L]
U8  LM1117IMP-5.0/NOPB  [DCY0004A_M]
U?  LTC4412ES6#TRMPBF  [FP-S6-6-05-08-1636-IPC_C]

### Ports
3V3 (out, see BRZ_BATT_MGR[3A]), 5V (out, see BRZ_BATT_MGR[3A]), BATT_PWR (in, see BRZ_BATT_MGR[2A]), CAR_PWR (in, see BRZ_BATT_MGR[2A]), EN1 (in, see BRZ_BATT_MGR[2A]), EN2 (in, see BRZ_BATT_MGR[2A]), INT_3V3_SENSE (out, see BRZ_BATT_MGR[3A], STM32H730_PINOUT[7A]), INT_5V_SENSE (out, see BRZ_BATT_MGR[3A], STM32H730_PINOUT[7A])

### Nets
3V3: C29.1 R57.2 R?#1.1 U7.2(OUT) U7.4(TAB) ; port 3V3
5V: C31.1 R59.2 U8.2(OUT) U8.4(TAB) ; port 5V
GND: C28.2 C29.2 C30.2 C31.2 Q?#4.2(S) R58.1 R60.2 R?#4.1 U7.1(GND) U8.1(GND) U?.2(GND) U?.3(CTL)
PWR_OUT: D?#1.2(A) ; port CAR_PWR
PWR_OUT: Q?#3.5-6-7-8(D) U?.1(VIN) ; port BATT_PWR  [a separate net that carries the same name]
CAN_INH: D?#2.2(A) ; port EN1
CAN_INH: D?#3.2(A) ; port EN2  [a separate net that carries the same name]
EN_MOSFET: Q?#1.4(G) Q?#2.4(G) Q?#4.3(D) R?#2.1
INT_3V3_SENSE: R57.1 R58.2 ; port INT_3V3_SENSE
INT_5V_SENSE: R59.1 R60.1 ; port INT_5V_SENSE
OR_MOS_GATE: Q?#3.4(G) U?.5(GATE)
PWR_IN: D?#1.1(C) Q?#2.5-6-7-8(D) Q?#3.1(S) Q?#3.2(S) Q?#3.3(S) R?#2.2 U?.6(SENSE)
STAT: R?#1.2 U?.4(STAT)
NetC28_1: C28.1 C30.1 Q?#1.5-6-7-8(D) U7.3(IN) U8.3(IN)
NetD?#2_1: D?#2.1(C) D?#3.1(C) R?#3.2
NetQ?#1_1: Q?#1.1(S) Q?#2.3(S)
NetQ?#1_2: Q?#1.2(S) Q?#2.2(S)
NetQ?#1_3: Q?#1.3(S) Q?#2.1(S)
NetQ?#4_1: Q?#4.1(G) R?#3.1 R?#4.2

### Notes on the sheet
- NO NEED FOR BEEFIER REGS
- ORING CONTROLLER
- FOR CAN INH PINS
- UNLABELLED RESISTORS ARE 10K

### Library data of the parts
C28-C31 = CMP-06035-045268-1: Chip Multilayer Ceramic Capacitors for General Purpose, 0603, 10uF, X5R, 15%, 10%, 25V; Case/Package: 0603
D?#1 = CMP-14398-000051-1: DIODE SCHOTTKY 30V 5A SOD128; RoHS Compliant: Yes
D?#2 D?#3 = CMP-2000-04993-2: DIODE GEN PURP 100V 150MA SOD123; Max Reverse Leakage Current: 5uA; Max Surge Current: 2A; Reverse Recovery Time: 4ns; Polarity: Standard; Capacitance: 4pF; Max Forward Surge Current (Ifsm): 1A; Element Configuration: Single; Power Dissipation: 400mW; Forward Voltage: 1V; Radiation Hardening: No; Lead Free: Lead Free; Max Reverse Voltage (DC): 100V; Current Rating: 150mA; Forward Current: 150mA; Packaging: Tape and Reel; Number of Pins: 2; Package Quantity: 3000; Max Operating Temperature: 150°C; Min Operating Temperature: -65°C; Average Rectified Current: 150mA; Recovery Time: 4ns; Output Current: 150mA; Peak Non-Repetitive Surge Current: 2A; Width: 1.8mm; Voltage Rating (DC): 100V; Height: 1.2mm; Max Repetitive Reverse Voltage (Vrrm): 100V; Mount: Surface Mount; Length: 2.85mm
Q?#1-Q?#3 = CMP-013-00036-1: as Q5 on sheet PWR_PROT
Q?#4 = CMP-2000-05968-1: as Q7 on sheet PWR_PROT; Manufacturer URL: http://www.diodes.com/; Series: BSS138; Package Description: 3-Pin Small Outline Transistor, Body 2 x 1.25 mm, Pitch 0.65 mm; Mounting Technology: SurfaceMount; Product Category: MOSFET; RoHS: True; Maximum Operating Temperature: +150C; Height: 1mm; Length: 2.2mm; Technology: Si; Width: 1.35mm; Datasheet URL: http://www.diodes.com/_files/datasheets/ds30206.pdf; Manufacturer: DiodesIncorporated; Package / Case: SOT-323-3; Typical Turn-On Delay Time: 20ns; Transistor Polarity: N-Channel; Factory Pack Quantity: 3000; Packaging: Reel; Product: MOSFETSmallSignal; Datasheet Version: Rev. 11-2, 09/2013; Package Reference: SOT323; Minimum Operating Temperature: -55C; Mounting Style: SMD/SMT; Channel Mode: Enhancement
R57-R60 R?#1 R?#2 R?#4 = CMP-1012-00623-3: as R31 on sheet PWR_PROT; Number of Pins: 2; Package Reference: 603; Depth: 0.8mm; Mount: SurfaceMount; Package Description: 2-Pin Surface Mount Device, Body 1.6 x 0.85 mm; Datasheet Version: 02/2017; Length: 1.6mm; Lead Free: LeadFree; Height: 0.45mm; Number of Terminations: 2; Max Power Dissipation: 100mW; Min Operating Temperature: -55degC; Datasheet URL: https://industrial.panasonic.com/cdbs/www-data/pdf/RDA0000/AOA0000C304.pdf; Termination: SMD/SMT; Case Code (Metric): 1608; Case Code (Imperial): 0603; Tolerance: 1%; Max Operating Temperature: 155degC; RoHSCompliant: true; Voltage Rating (DC): 75V; Radiation Hardening: No; Packaging: TapeandReel; Composition: ThickFilm; Mounting Technology: SurfaceMount; Manufacturer URL: http://www.panasonic.com/; Width: 0.031inch; REACH SVHC: NoSVHC; Contact Plating: Tin; Military Standard: Not; Package Quantity: 1
R?#3 = CMP-2000-00180-1: Manufacturer: Panasonic; Part Number: ERJ-3EKF1001V
U7 = CMP-0062-01638-4: 800mA Low-Dropout Linear Regulator, 4-pin SOT-223, Pb-Free; Manufacturer: Texas Instruments; CompType: LDO IC; PackageTopMarking: XYTT*N05A; High-Reliability: Y; PowerWise: N; ComponentLink1URL: http://www.ti.com/general/docs/lit/getliterature.tsp?genericPartNumber=LM1117-N&fileType=pdf; PinCount: 4; PackageDescription: Molded SOT-223, 6.50 x 3.56 x 1.6mm Body, 4 Lead, 2.3mm Pitch; Code_IPC: SOT223-4; PartNumber: LM1117MP-3.3/NOPB; Code_JEDEC: TO-261-AA; RoHS: Y; PackageReference: DCY0004A; ComponentLink1Description: Datasheet URL
U8 = CMP-0062-01627-4: 800mA Low-Dropout Linear Regulator, 4-pin SOT-223, Pb-Free; Manufacturer: Texas Instruments; PackageTopMarking: XYTT*N06B; CompType: LDO IC; PowerWise: N; High-Reliability: Y; RoHS: Y; Code_JEDEC: TO-261-AA; ComponentLink1URL: http://www.ti.com/general/docs/lit/getliterature.tsp?genericPartNumber=LM1117-N&fileType=pdf; Code_IPC: SOT223-4; ComponentLink1Description: Datasheet URL; PartNumber: LM1117IMP-5.0/NOPB; PackageReference: DCY0004A; PinCount: 4; PackageDescription: Molded SOT-223, 6.50 x 3.56 x 1.6mm Body, 4 Lead, 2.3mm Pitch
U? = CMP-0479-00425-2: IC OR CTRLR SRC SELECT TSOT23-6; Min Supply Voltage: 2.5V; Max Supply Voltage: 28V; Turn-On Delay Time: 110us; Number of Channels: 1; Lead Free: Lead Free; Length: 2.9mm; Radiation Hardening: No; RoHS Compliant: Yes; Package Quantity: 1; Min Operating Temperature: -40°C; Series: PowerPath™; Packaging: Tape and Reel; Width: 1.75mm; Height: 0.9mm; Number of Pins: 6; Max Operating Temperature: 85°C; Number of Outputs: 1; Case/Package: TSOT; REACH SVHC: No SVHC

## Sheet BATT_CHG.SchDoc
size C; SheetNumber: 5; SheetTotal: 8
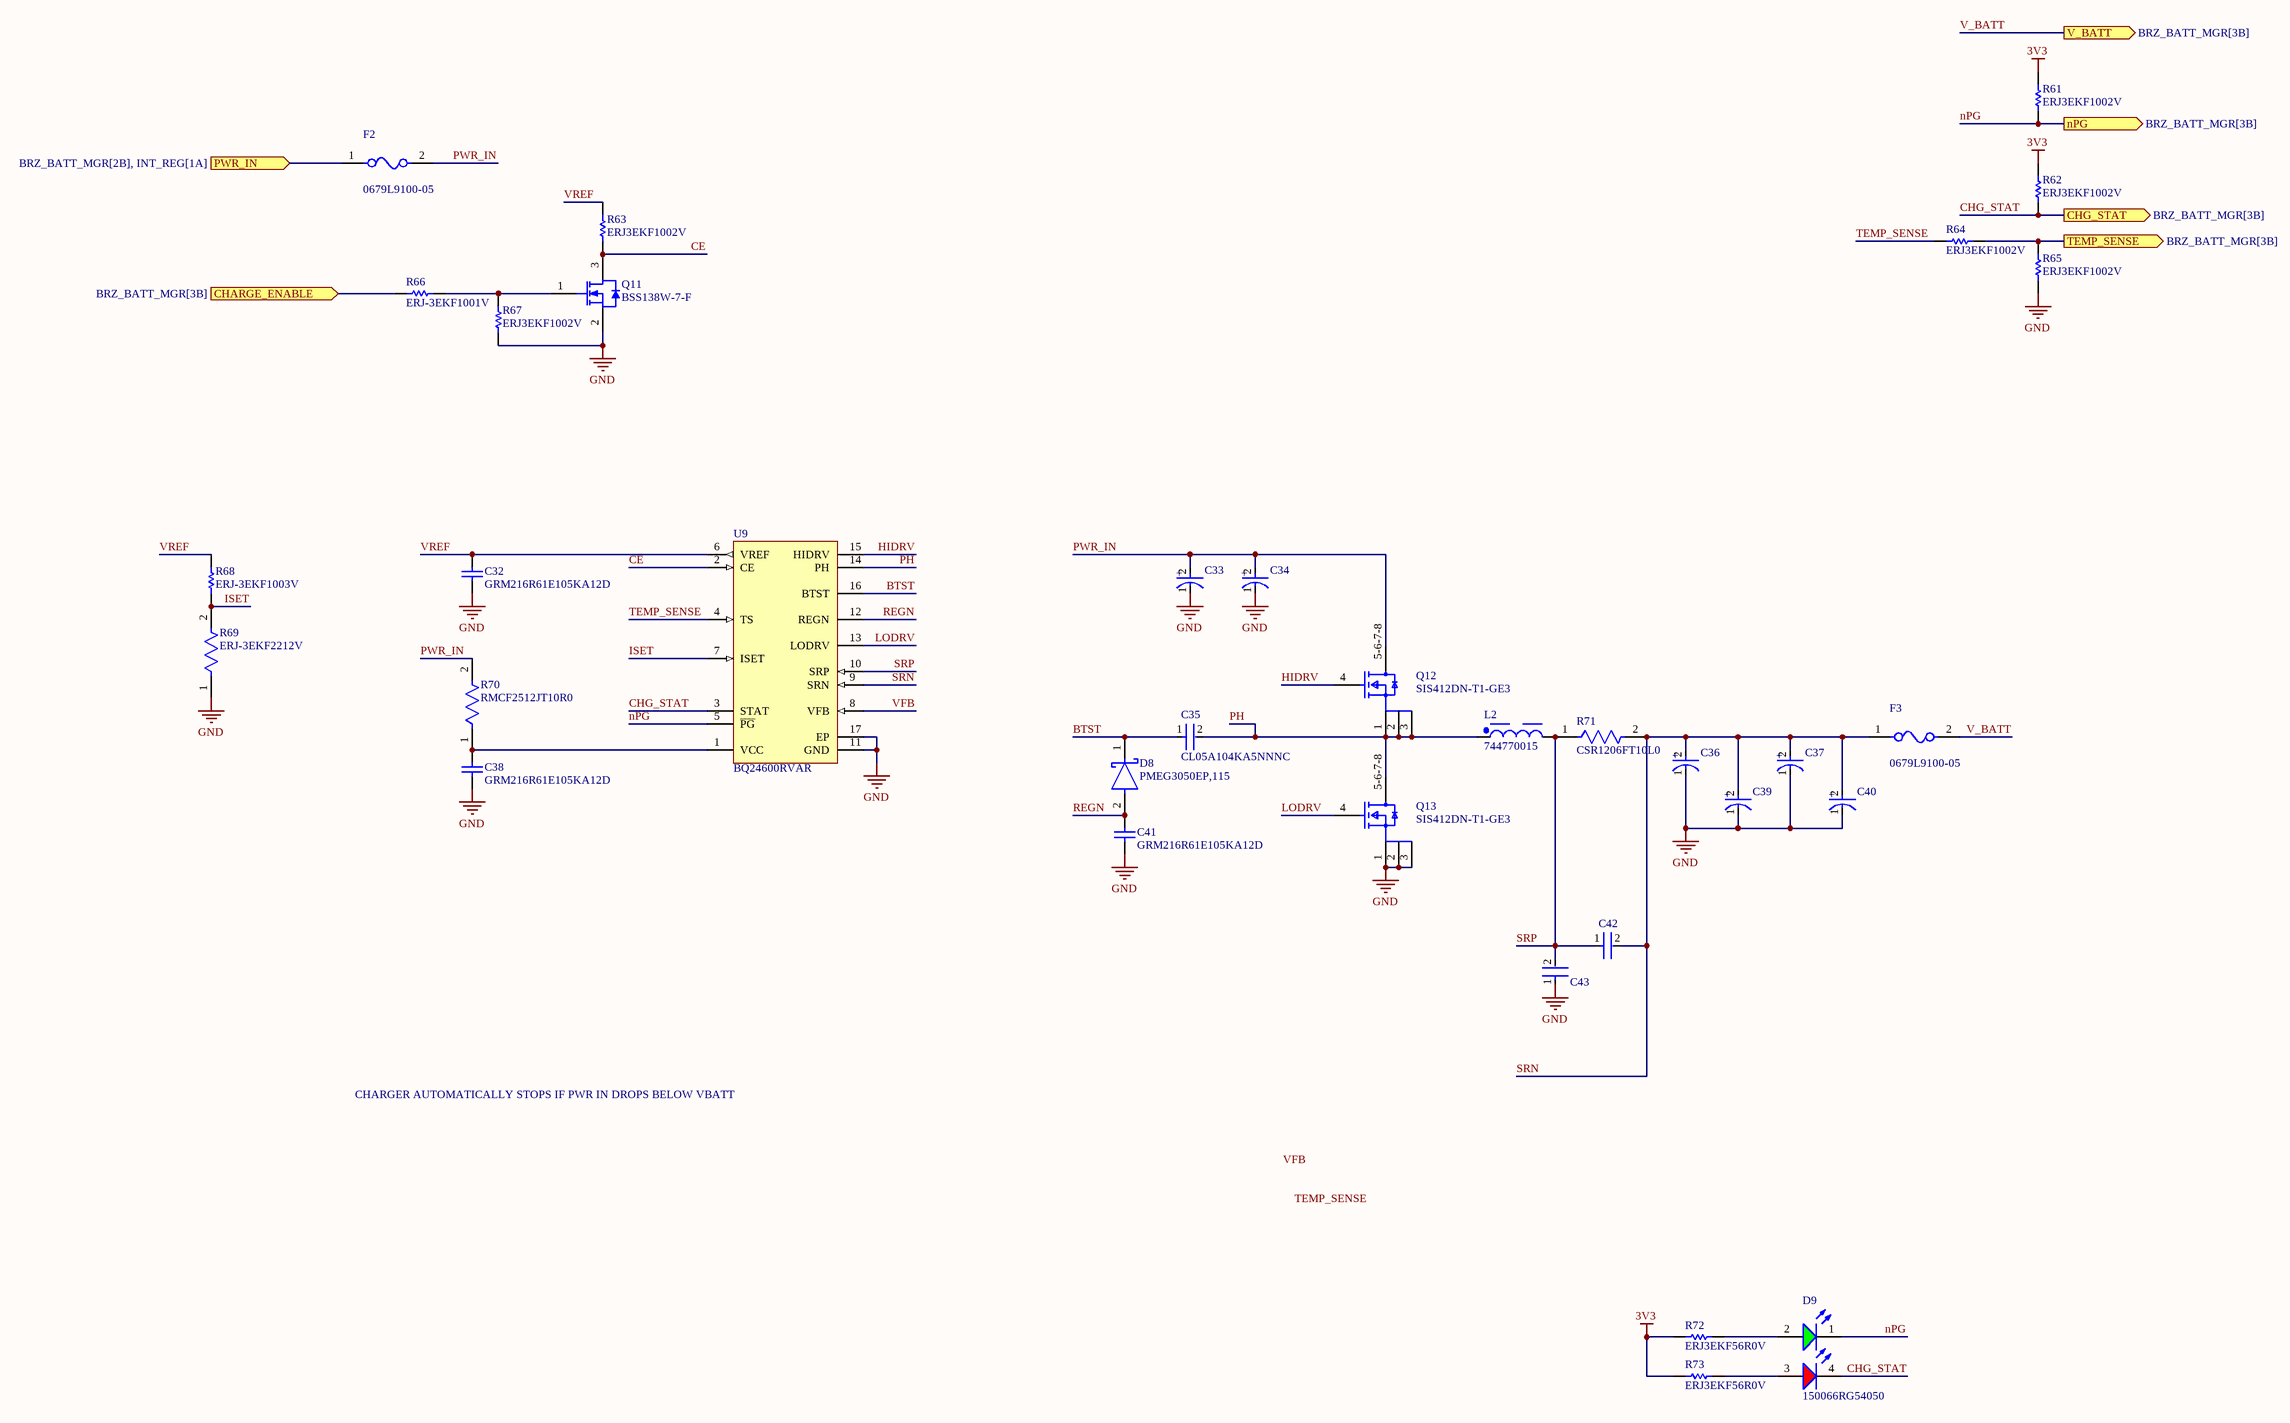
[diagram p4: BATT_CHG.SchDoc]

### Parts
C32  GRM216R61E105KA12D  [CAPC2013X70X45NL10T25]
C33  50SVPF10M  [FP-OS-CON-SMT-C6-MFG]  (value not drawn)
C34  50SVPF10M  [FP-OS-CON-SMT-C6-MFG]  (value not drawn)
C35  CL05A104KA5NNNC  [FP-CL278-IPC_C]
C36  50SVPF10M  [FP-OS-CON-SMT-C6-MFG]  (value not drawn)
C37  50SVPF10M  [FP-OS-CON-SMT-C6-MFG]  (value not drawn)
C38  GRM216R61E105KA12D  [CAPC2013X70X45NL10T25]
C39  50SVPF10M  [FP-OS-CON-SMT-C6-MFG]  (value not drawn)
C40  50SVPF10M  [FP-OS-CON-SMT-C6-MFG]  (value not drawn)
C41  GRM216R61E105KA12D  [CAPC2013X70X45NL10T25]
C42  CL05A104KA5NNNC  [FP-CL278-IPC_C]  (value not drawn)
C43  CL05A104KA5NNNC  [FP-CL278-IPC_C]  (value not drawn)
D8  PMEG3050EP,115  [FP-SOD128-MFG]
D9  150066RG54050  [WL-SBCD_0606]
F2  0679L9100-05  [FP-0679L-MFG]
F3  0679L9100-05  [FP-0679L-MFG]
L2  744770015  [WE-PD_1280]
Q11  BSS138W-7-F  [DIOD-SOT323-3_V]
Q12  SIS412DN-T1-GE3  [FP-S16-2667-SINGLE-MFG]
Q13  SIS412DN-T1-GE3  [FP-S16-2667-SINGLE-MFG]
R61  ERJ3EKF1002V  [RESC1609X55X30LL15T15]
R62  ERJ3EKF1002V  [RESC1609X55X30LL15T15]
R63  ERJ3EKF1002V  [RESC1609X55X30LL15T15]
R64  ERJ3EKF1002V  [RESC1609X55X30LL15T15]
R65  ERJ3EKF1002V  [RESC1609X55X30LL15T15]
R66  ERJ-3EKF1001V  [RESC1608X55X30LL15T15]
R67  ERJ3EKF1002V  [RESC1609X55X30LL15T15]
R68  ERJ-3EKF1003V  [RESC1608X55X30ML15T15]
R69  ERJ-3EKF2212V  [FP-ERJ3EK-MFG]
R70  RMCF2512JT10R0  [FP-RMCF2512-IPC_B]
R71  CSR1206FT10L0  [FP-CSR1206-IPC_C]
R72  ERJ3EKF56R0V  [RESC1608X55X30NL15T15]
R73  ERJ3EKF56R0V  [RESC1608X55X30NL15T15]
U9  BQ24600RVAR  [RVA0016A_V]

### Ports
CHARGE_ENABLE (in, see BRZ_BATT_MGR[3B]), CHG_STAT (out, see BRZ_BATT_MGR[3B]), nPG (out, see BRZ_BATT_MGR[3B]), PWR_IN (in, see BRZ_BATT_MGR[2B], INT_REG[1A]), TEMP_SENSE (out, see BRZ_BATT_MGR[3B]), V_BATT (out, see BRZ_BATT_MGR[3B])

### Nets
3V3: R61.2 R62.2 R72.2 R73.2
GND: C32.1 C33.1(C) C34.1(C) C36.1(C) C37.1(C) C38.1 C39.1(C) C40.1(C) C41.1 C43.1 Q11.2(S) Q13.1(S) Q13.2(S) Q13.3(S) R65.1 R67.1 R69.1 U9.11(GND) U9.17(EP)
PWR_OUT: F2.1 ; port PWR_IN
V_BATT: F3.2 ; port V_BATT  [project net PWR_IN]
BATT_CHG_ENABLE: R66.2 ; port CHARGE_ENABLE
BATT_TEMP_SENSE: R64.1 R65.2 ; port TEMP_SENSE
BTST: C35.1 D8.1(C) U9.16(BTST)
CE: Q11.3(D) R63.1 U9.2(CE)
CHG_STAT: D9.4(K) R62.1 U9.3(STAT) ; port CHG_STAT  [project net BATT_CHG_STAT]
HIDRV: Q12.4(G) U9.15(HIDRV)
ISET: R68.1 R69.2 U9.7(ISET)
LODRV: Q13.4(G) U9.13(LODRV)
nPG: D9.1(K) R61.1 U9.5(~{PG}) ; port nPG  [project net BATT_nPG]
PH: C35.2 L2.1 Q12.1(S) Q12.2(S) Q12.3(S) Q13.5-6-7-8(D) U9.14(PH)
PWR_IN: C33.2(A) C34.2(A) F2.2 Q12.5-6-7-8(D) R70.2
REGN: C41.2 D8.2(A) U9.12(REGN)
SRN: C36.2(A) C37.2(A) C39.2(A) C40.2(A) C42.2 F3.1 R71.2 U9.9(SRN)
SRP: C42.1 C43.2 L2.2 R71.1 U9.10(SRP)
TEMP_SENSE: R64.2 U9.4(TS)
VFB: U9.8(VFB)
VREF: C32.2 R63.2 R68.2 U9.6(VREF)
NetC38_2: C38.2 R70.1 U9.1(VCC)
NetD9_2: D9.2(A) R72.1
NetD9_3: D9.3(A) R73.1
NetQ11_1: Q11.1(G) R66.1 R67.2

### Notes on the sheet
- CHARGER AUTOMATICALLY STOPS IF PWR IN DROPS BELOW VBATT
- Labels drawn without touching a wire or pin: TEMP_SENSE, VFB
- (in symbol CMP-05428-000804-1) +

### Library data of the parts
C32 C38 C41 = CMP-2007-00957-1: Manufacturer: Murata; Part Number: GRM216R61E105KA12D
C33 C34 C36 C37 C39 C40 = CMP-05428-000804-1: Conductive Polymer Aluminum Solid Capacitors (OS-CON) 10uF ±20% 50V; ESR (Equivalent Series Resistance): 40mR; Ripple Current: 2.5A; Leakage Current: 100uA; Life (Hours): 5000Hour; Dissipation Factor: 12%; Voltage Rating (DC): 50V; Termination: SMD/SMT; Voltage Rating: 50V; Voltage: 50V; Min Operating Temperature: -55°C; Max Operating Temperature: 105°C; Height - Seated (Max): 0.236inch; Case/Package: Radial; Mount: Surface Mount; Height: 5.9mm; RoHS Compliant: Yes; Diameter: 6.3mm; Construction: Cylindrical; Ripple Current (AC): 2.5A; Series: OS-CON, SVPF; Length: 5.9mm; Package Quantity: 1000; REACH SVHC: No SVHC; Number of Pins: 6; Capacitance: 10uF; Packaging: Tape and Reel; Lead Free: Lead Free; Tolerance: 20%
C35 C42 C43 = CMP-13271-000728-1: Cap Ceramic 100nF 25V X5R ±10% SMD 0402 +85°C Paper T/R; Package Quantity: 1; Height: 0.5mm; Case Code (Metric): 1005; Thickness: 0.022inch; Mount: Surface Mount; Lead Free: Lead Free; Case Code (Imperial): 0402; Packaging: Tape and Reel; Depth: 0.5mm; Voltage: 25V; Min Operating Temperature: -55°C; Voltage Rating: 25V; Dielectric: X5R; Case/Package: 0402; Tolerance: 10%; Width: 0.02inch; Max Operating Temperature: 85°C; Capacitance: 100nF; Length: 1mm; Radiation Hardening: No; Voltage Rating (DC): 25V
D8 = CMP-14398-000051-1: DIODE SCHOTTKY 30V 5A SOD128; RoHS Compliant: Yes
D9 = CMP-004-00034-2: Led, Red/Grn, 180Mcd/230Mcd, 624Nm/525Nm Rohs Compliant: Yes
F2 F3 = CMP-16042-000002-1: as F1 on sheet PWR_PROT; Device Class L2: Fuses; ComponentLink2URL: https://www.belfuse.com/resources/CircuitProtection/datasheets/0679L%20Sep2016.pdf; Package: 0679L; Height: 2.79mm; Digikey Description: FUSE BRD MNT 15A 125VAC/VDC; Temperature Range High: +125°C; Device Class L3: unset; Octopart: https://octopart.com/0679l9150-01-bel+fuse-70850665; Temperature Range Low: -55°C; Max Fuse Dc Voltage: 125V; Ipc Land Pattern Name: CAPC610254X254; Category: Fuse; Lead Free: Yes; Automotive: Yes; Resistance: 0.0038Ω; RoHS: TRUE; Device Class L1: Circuit Protection; ComponentLink2Description: Datasheet; Temperature: -55°C to +125°C; Voltage Rating: 125V
L2 = CMP-03913-22866870-1: 744770015 Fixed Ind 1.5UH 10A 6 Mohm SMD; Test Frequency: 100kHz; Core Material: Ferrite; DC Resistance (DCR): 3.2mΩ; Inductance: 1.5µH; Series Resistance: 6mΩ; Current Rating: 16.5A; Self Resonant Frequency: 42MHz; Inductance Tolerance: 20%; Shielding: Shielded; Saturation Current: 12A; Width: 12mm; Mount: Surface Mount; NexarPartId: 22866870; Ambient Temperature Range Low: -40°C; Length: 12mm; Max DC Current: 10A; Resistance: 6mΩ; RMS Current (Irms): 10A; RoHS: Compliant; Case/Package: 1280; Lead Free: Lead Free; Termination: SMD/SMT; Min Operating Temperature: -40°C; Height: 8mm; Tolerance: 20%; REACH SVHC: Unknown; Max Operating Temperature: 125°C; Ambient Temperature Range High: 85°C; Packaging: Cut Tape (CT)
Q11 = CMP-2000-05968-1: as Q7 on sheet PWR_PROT; Manufacturer URL: http://www.diodes.com/; Series: BSS138; Package Description: 3-Pin Small Outline Transistor, Body 2 x 1.25 mm, Pitch 0.65 mm; Mounting Technology: SurfaceMount; Product Category: MOSFET; RoHS: True; Maximum Operating Temperature: +150C; Height: 1mm; Length: 2.2mm; Technology: Si; Width: 1.35mm; Datasheet URL: http://www.diodes.com/_files/datasheets/ds30206.pdf; Manufacturer: DiodesIncorporated; Package / Case: SOT-323-3; Typical Turn-On Delay Time: 20ns; Transistor Polarity: N-Channel; Factory Pack Quantity: 3000; Packaging: Reel; Product: MOSFETSmallSignal; Datasheet Version: Rev. 11-2, 09/2013; Package Reference: SOT323; Minimum Operating Temperature: -55C; Mounting Style: SMD/SMT; Channel Mode: Enhancement
Q12 Q13 = CMP-02550-000138-1: MOSFET N-CH 30V 12A 1212-8 PPAK; Manufacturer: Vishay; Depletion Mode: False; Max Forward Diode Voltage: 1.2V; Max Junction Temp: +150°C; Input Capacitace At Vds: 435pF @ 15V; Number Of N Channels: 1; Gate Charge At Vgs: 8nC @ 10V; Threshold Vgs Max: 2.5V; Turn On Delay Time: 5ns; Drain To Source Resistance: 0.02Ω; Rthja Max: 32°C/W; Turn Off Delay Time: 15ns; Standoff Height: 0mm; Power Dissipation: 3.2W; Pulse Drain Current: 30A; Continuous Drain Current: 8.7A; Threshold Vgs Min: 1V; Gate To Source Voltage: 20V; Typ Forward Diode Voltage: 0.8V; Reverse Recovery Charge: 7nC; Transconductance: 17S; Device Class L3: MOSFETs; Temperature Range Low: -55°C; RoHS: TRUE; Automotive: No; Lead Free: Yes; Number Of Channels: 1; Octopart: https://octopart.com/sis412dn-t1-ge3-vishay-42759401; Manufacturer Part Number: SIS412DN-T1-GE3; ComponentLink2Description: Datasheet; Digikey Description: MOSFET N-CH 30V 12A 1212-8 PPAK; Height: 1.17mm; Drain To Source Breakdown Voltage: 30V; Device Class L2: Transistors; Temperature: -55°C to +150°C; Drain To Source Voltage: 30V; Mouser Description: MOSFET 30V 12A 15.6W; Device Class L1: Discrete Semiconductors; Temperature Range High: +150°C; Category: Trans; ComponentLink2URL: http://www.vishay.com/docs/69006/sis412dn.pdf; Package: S16-2667-SINGLE; Reverse Recovery Time: 15ns
R61-R65 R67 = CMP-1012-00623-3: as R31 on sheet PWR_PROT; Number of Pins: 2; Package Reference: 603; Depth: 0.8mm; Mount: SurfaceMount; Package Description: 2-Pin Surface Mount Device, Body 1.6 x 0.85 mm; Datasheet Version: 02/2017; Length: 1.6mm; Lead Free: LeadFree; Height: 0.45mm; Number of Terminations: 2; Max Power Dissipation: 100mW; Min Operating Temperature: -55degC; Datasheet URL: https://industrial.panasonic.com/cdbs/www-data/pdf/RDA0000/AOA0000C304.pdf; Termination: SMD/SMT; Case Code (Metric): 1608; Case Code (Imperial): 0603; Tolerance: 1%; Max Operating Temperature: 155degC; RoHSCompliant: true; Voltage Rating (DC): 75V; Radiation Hardening: No; Packaging: TapeandReel; Composition: ThickFilm; Mounting Technology: SurfaceMount; Manufacturer URL: http://www.panasonic.com/; Width: 0.031inch; REACH SVHC: NoSVHC; Contact Plating: Tin; Military Standard: Not; Package Quantity: 1
R66 = CMP-2000-00180-1: Manufacturer: Panasonic; Part Number: ERJ-3EKF1001V
R68 = CMP-2000-00182-1: Manufacturer: Panasonic; Part Number: ERJ-3EKF1003V
R69 = CMP-1012-00660-3: RES SMD 22.1K OHM 1% 1/10W 0603; Voltage Rating (DC): 50V; Power Rating: 100mW; Temperature Coefficient: 100ppm/°C; Resistance: 22.1kR; Voltage Rating: 75V; Radiation Hardening: No; Termination: SMD/SMT; Max Operating Temperature: 155°C; Series: ERJ; Technology: THICK FILM; Resistance Tolerance: 1%; Tolerance: 1%; RoHS Compliant: Yes; Length: 1.6mm; Package Quantity: 1; Case Code (Metric): 1608; Size Code: 0603; Case Code (Imperial): 0603; Military Standard: Not; Case/Package: 0603; Contact Plating: Tin; Width: 0.031inch; Packaging: Tape and Reel; REACH SVHC: No SVHC; Construction: Rectangular; Number of Terminations: 2; Max Power Dissipation: 100mW; Resistor Type: Thick Film; Height: 0.45mm; Features: Automotive AEC-Q200; Min Operating Temperature: -55°C; Lead Free: Lead Free; Depth: 0.8mm; Mount: Surface Mount
R70 = CMP-26527-002316-1: 10Ω ±5% 1W 2512 Thick Film Chip Resistor AEC-Q200 compliant; Temperature Coefficient: 200ppm/°C; Resistance: 10R; Height: 0.028inch; RoHS Compliant: Yes; Military Standard: Not; Packaging: Tape and Reel; Depth: 3.2mm; Number of Terminations: 2; Width: 0.126inch; Case Code (Imperial): 2512; Lead Free: Lead Free; Size Code: 2512; Mount: Surface Mount; Max Power Dissipation: 1W; Case/Package: 2512; Contact Plating: Tin; Radiation Hardening: No; Case Code (Metric): 6432; Length: 0.248inch; Series: RMCF; Construction: Rectangular; Features: Automotive AEC-Q200; Power Rating: 1W; Max Operating Temperature: 155°C; Resistor Type: Thick Film; Tolerance: 5%; Min Operating Temperature: -55°C
R71 = CMP-26527-001047-1: General Purpose Thick Film Chip Resistor, 1206, 10mΩ, 1%, 0.5W; Temperature Coefficient: 100ppm/°C; Max Power Dissipation: 500mW; Resistance: 10mR; Construction: Rectangular; Height: 0.026inch; Number of Terminations: 2; Max Operating Temperature: 155°C; Case/Package: 1206; Packaging: Tape and Reel; Mount: Surface Mount; Military Standard: Not; Min Operating Temperature: -55°C; RoHS Compliant: Yes; Series: CSR; Radiation Hardening: No; Case Code (Metric): 3216; Length: 0.12inch; Tolerance: 1%; Width: 0.061inch; Depth: 1.55mm; Resistor Type: Thick Film; Case Code (Imperial): 1206; Contact Plating: Tin
R72 R73 = CMP-2000-00572-1: Manufacturer: Panasonic; Part Number: ERJ3EKF56R0V
U9 = CMP-0321-00212-2: Standalone Synchronous Switch-Mode Charge Controller, 5 V, -40 to 85 degC, 16-pin VQFN (RVA), Green (RoHS & no Sb/Br); Manufacturer: Texas Instruments; Over Voltage Protection: N; Vin(Min)(V): 5; SubFamily: Battery Charge Management; Mounting Technology: Surface Mount; PartNumber: BQ24600RVAR; PackageReference: RVA0016A; ComponentLink1Description: Datasheet; ComponentLink1URL: http://www.ti.com/general/docs/lit/getliterature.tsp?genericPartNumber=BQ24600&fileType=pdf; PackageVersion: revC, May-2011; Lead Acid: N; DatasheetVersion: SLUS891A; NiCd: N; Eco-Plan: Green (RoHS & no Sb/Br); NiMH: N; Li-Ion: N; PackageDescription: 16-Pin Plastic Quad Flatpack No-Lead, 3.5 x 3.5 mm Body, 0.5 mm Pitch, Exposed Pad; Li-Polymer: N